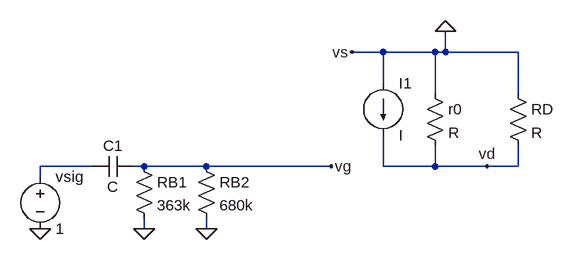
[diagram p0: schematic Draft1.asc]
Draft1.asc, the LTspice schematic file:
Version 4
SHEET 1 880 680
WIRE 304 -32 256 -32
WIRE 384 -32 304 -32
WIRE 400 -32 400 -64
WIRE 400 -32 384 -32
WIRE 512 -32 400 -32
WIRE 304 16 304 -32
WIRE 384 32 384 -32
WIRE 512 32 512 -32
WIRE -144 144 -224 144
WIRE -64 144 -80 144
WIRE 32 144 -64 144
WIRE 224 144 32 144
WIRE 304 144 304 96
WIRE 384 144 384 112
WIRE 384 144 304 144
WIRE 464 144 384 144
WIRE 512 144 512 112
WIRE 512 144 464 144
WIRE -224 160 -224 144
WIRE -64 240 -64 224
WIRE 32 240 32 224
FLAG -64 240 0
FLAG 32 240 0
FLAG 400 -64 0
FLAG -224 240 0
FLAG 256 -32 vs
FLAG 224 144 vg
FLAG 464 144 vd
SYMBOL res -80 128 R0
SYMATTR InstName RB1
SYMATTR Value 363k
SYMBOL res 16 128 R0
SYMATTR InstName RB2
SYMATTR Value 680k
SYMBOL res 368 16 R0
SYMATTR InstName r0
SYMBOL res 496 16 R0
SYMATTR InstName RD
SYMBOL current 304 16 R0
SYMATTR InstName I1
SYMBOL voltage -224 144 R0
WINDOW 123 0 0 Left 0
WINDOW 39 0 0 Left 0
SYMATTR InstName vsig
SYMATTR Value 1
SYMBOL cap -80 128 R90
WINDOW 0 0 32 VBottom 2
WINDOW 3 32 32 VTop 2
SYMATTR InstName C1

The netlist it stands for:
* Draft1.asc
RB1 vg 0 363k
RB2 vg 0 680k
r0 0 vd R
RD 0 vd R
I1 0 vd I
vsig N001 0 1
C1 vg N001 C
.backanno
.end